# Altium schematic sheet Private_CPU_USB.SchDoc
size D
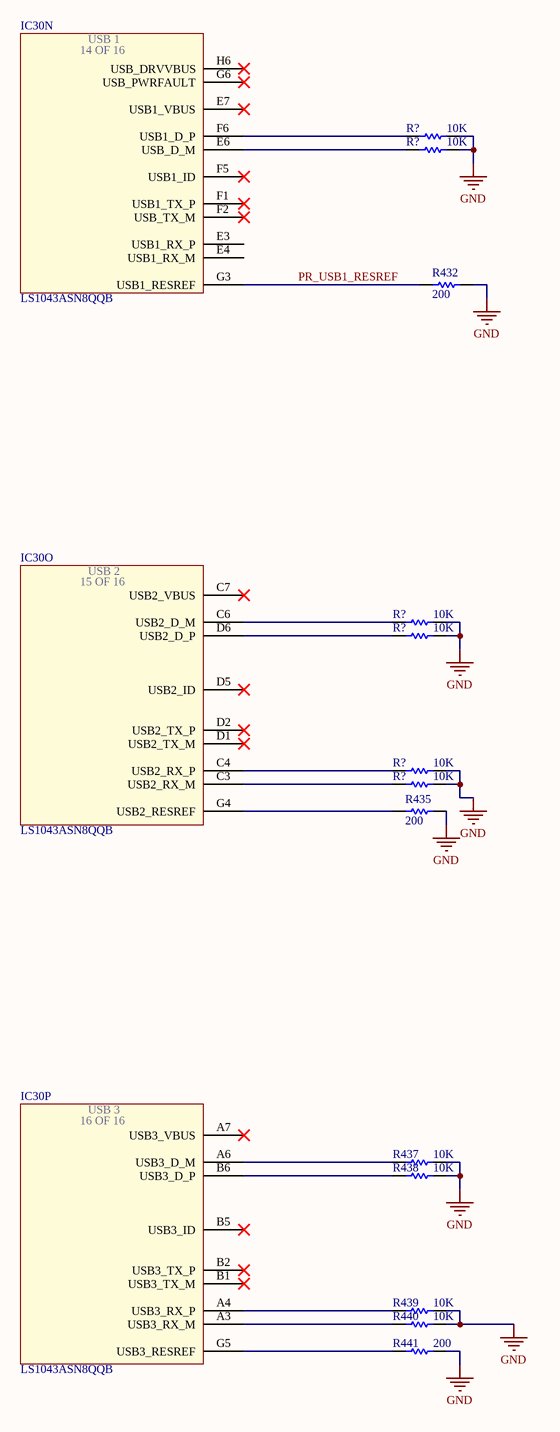
[diagram p0: Private_CPU_USB.SchDoc]

## Parts
(Parts that share a designator on the sheet are numbered #1, #2 ... from top to bottom, then left to right.)
IC30  LS1043ASN8QQB  [BGA780C80P28X28_2300X2300X261]  (parts N,O,P of 16)
R432  200  [RESC1005X40X25ML05T05]
R435  200  [RESC1005X40X25ML05T05]
R437  10K  [RESC1005X40X25LL05T10]
R438  10K  [RESC1005X40X25LL05T10]
R439  10K  [RESC1005X40X25LL05T10]
R440  10K  [RESC1005X40X25LL05T10]
R441  200  [RESC1005X40X25ML05T05]
R?#1  10K  [RESC1005X40X25LL05T10]
R?#2  10K  [RESC1005X40X25LL05T10]
R?#3  10K  [RESC1005X40X25LL05T10]
R?#4  10K  [RESC1005X40X25LL05T10]
R?#5  10K  [RESC1005X40X25LL05T10]
R?#6  10K  [RESC1005X40X25LL05T10]

## Nets
GND: R432.2 R435.2 R437.2 R438.2 R439.2 R440.2 R441.2 R?#1.2 R?#2.2 R?#3.2 R?#4.2 R?#5.2 R?#6.2
PR_USB1_RESREF: IC30.G3(USB1_RESREF) R432.1
NetIC30_A3: IC30.A3(USB3_RX_M) R440.1
NetIC30_A4: IC30.A4(USB3_RX_P) R439.1
NetIC30_A6: IC30.A6(USB3_D_M) R437.1
NetIC30_B6: IC30.B6(USB3_D_P) R438.1
NetIC30_C3: IC30.C3(USB2_RX_M) R?#6.1
NetIC30_C4: IC30.C4(USB2_RX_P) R?#5.1
NetIC30_C6: IC30.C6(USB2_D_M) R?#3.1
NetIC30_D6: IC30.D6(USB2_D_P) R?#4.1
NetIC30_E6: IC30.E6(USB_D_M) R?#2.1
NetIC30_F6: IC30.F6(USB1_D_P) R?#1.1
NetIC30_G4: IC30.G4(USB2_RESREF) R435.1
NetIC30_G5: IC30.G5(USB3_RESREF) R441.1

Not connected (* = marked no-connect by the designer): IC30 A7(USB3_VBUS)* B1(USB3_TX_M)* B2(USB3_TX_P)* B5(USB3_ID)* C7(USB2_VBUS)* D1(USB2_TX_M)* D2(USB2_TX_P)* D5(USB2_ID)* E3(USB1_RX_P) E4(USB1_RX_M) E7(USB1_VBUS)* F1(USB1_TX_P)* F2(USB_TX_M)* F5(USB1_ID)* G6(USB_PWRFAULT)* H6(USB_DRVVBUS)*

## Notes on the sheet
- Title
- Size:
- Date:
- File:
- D
- Number:
- Time:
- Revision:
- Sheet
- of
- (in symbol LS1043ASN8QQB, part N) USB 1; 14 OF 16
- (in symbol LS1043ASN8QQB, part O) USB 2; 15 OF 16
- (in symbol LS1043ASN8QQB, part P) USB 3; 16 OF 16

## Library data of the parts
IC30 = LS1043ASN8QQB: Integrated Circuit; Manufacturer_Name: NXP; Datasheet Link: http://www.nxp.com/secured/assets/documents/en/data-sheet/LS1088A.pdf; Height: 2.61mm; Manufacturer_Part_Number: LS1043ASN8QQB; Mouser Part Number: 771-LS1043ASN8QQB; Mouser Price/Stock: https://www.mouser.co.uk/ProductDetail/NXP-Semiconductors/LS1043ASN8QQB/?qs=AQlKX63v8RsTATOTx7X0Jg%3D%3D
R432 R435 R441 = CMP-2002-08353-1: Part Number: CRCW0402200RJNED; Manufacturer: Vishay Dale
R437-R440 R?#1-R?#6 = CMP-2002-07353-1: Part Number: RC0402FR-0710KL; Manufacturer: Yageo / Phycomp